# Altium schematic sheet console_schematic_switches.SchDoc
size A4
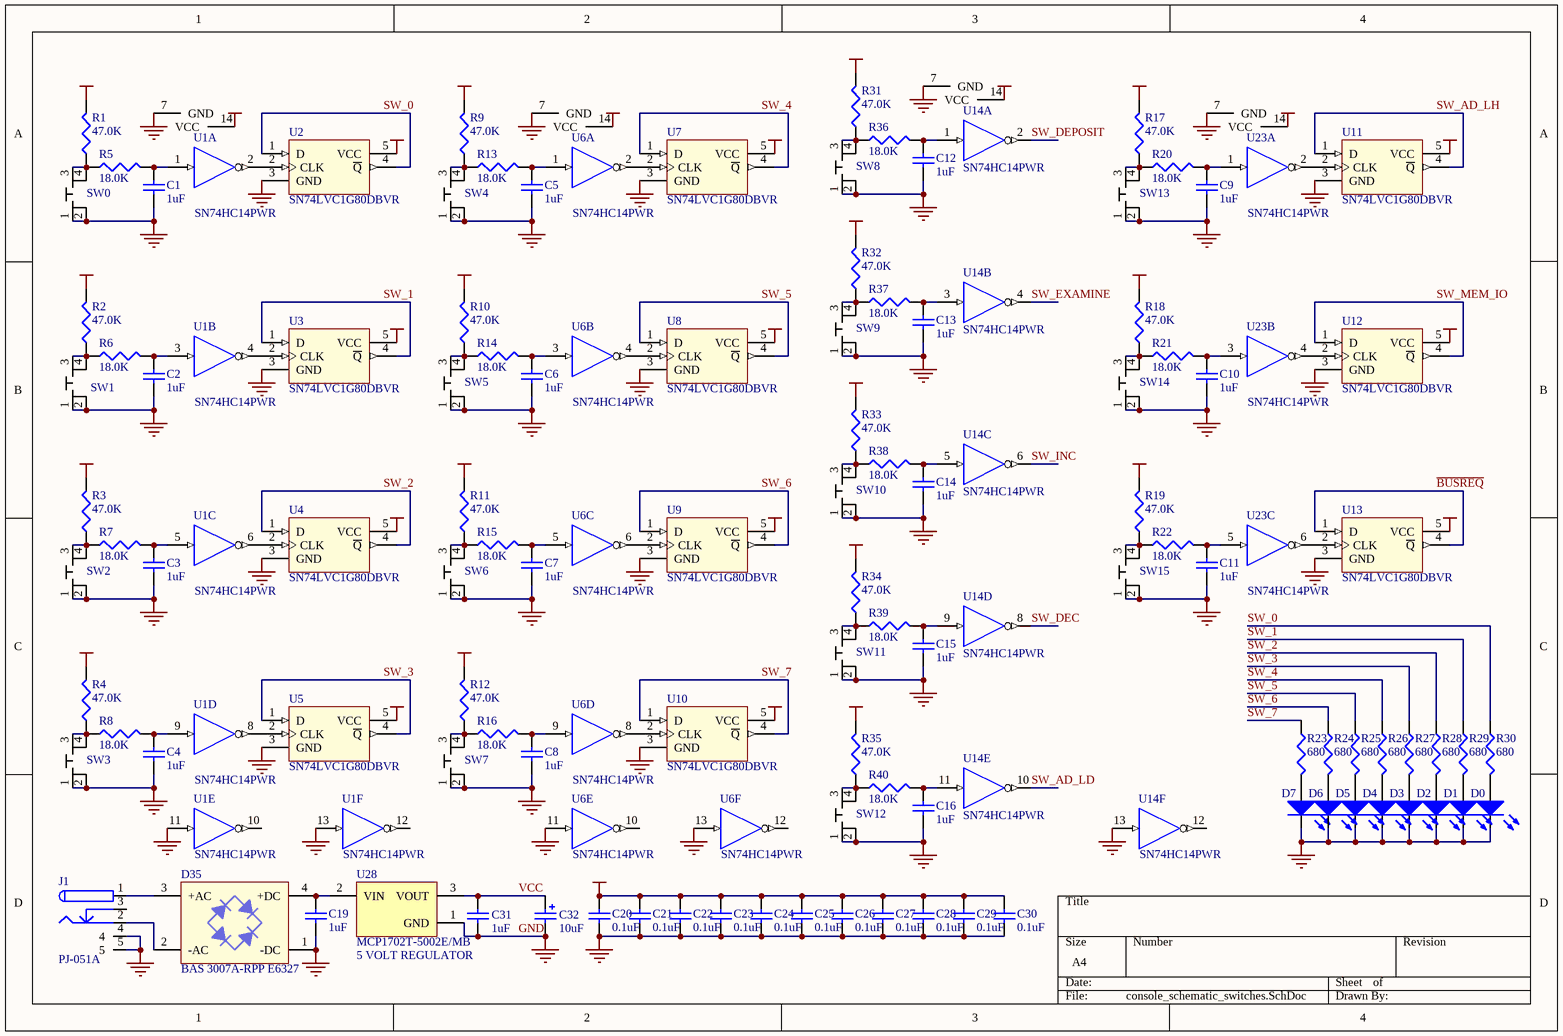
[diagram p0: console_schematic_switches.SchDoc]

## Parts
C1  1uF  [0805]
C2  1uF  [0805]
C3  1uF  [0805]
C4  1uF  [0805]
C5  1uF  [0805]
C6  1uF  [0805]
C7  1uF  [0805]
C8  1uF  [0805]
C9  1uF  [0805]
C10  1uF  [0805]
C11  1uF  [0805]
C12  1uF  [0805]
C13  1uF  [0805]
C14  1uF  [0805]
C15  1uF  [0805]
C16  1uF  [0805]
C19  1uF  [0805]
C20  0.1uF  [0603]
C21  0.1uF  [0603]
C22  0.1uF  [0603]
C23  0.1uF  [0603]
C24  0.1uF  [0603]
C25  0.1uF  [0603]
C26  0.1uF  [0603]
C27  0.1uF  [0603]
C28  0.1uF  [0603]
C29  0.1uF  [0603]
C30  0.1uF  [0603]
C31  1uF  [0805]
C32  10uF  [1206_A]
D0  LTST-C190KRKT  [APG1608]  (value not drawn)
D1  LTST-C190KRKT  [APG1608]  (value not drawn)
D2  LTST-C190KRKT  [APG1608]  (value not drawn)
D3  LTST-C190KRKT  [APG1608]  (value not drawn)
D4  LTST-C190KRKT  [APG1608]  (value not drawn)
D5  LTST-C190KRKT  [APG1608]  (value not drawn)
D6  LTST-C190KRKT  [APG1608]  (value not drawn)
D7  LTST-C190KRKT  [APG1608]  (value not drawn)
D35  BAS 3007A-RPP E6327  [SOT143]
J1  PJ-051A  [PJ-051A]
R1  47.0K  [0603]
R2  47.0K  [0603]
R3  47.0K  [0603]
R4  47.0K  [0603]
R5  18.0K  [0603]
R6  18.0K  [0603]
R7  18.0K  [0603]
R8  18.0K  [0603]
R9  47.0K  [0603]
R10  47.0K  [0603]
R11  47.0K  [0603]
R12  47.0K  [0603]
R13  18.0K  [0603]
R14  18.0K  [0603]
R15  18.0K  [0603]
R16  18.0K  [0603]
R17  47.0K  [0603]
R18  47.0K  [0603]
R19  47.0K  [0603]
R20  18.0K  [0603]
R21  18.0K  [0603]
R22  18.0K  [0603]
R23  680  [0603]
R24  680  [0603]
R25  680  [0603]
R26  680  [0603]
R27  680  [0603]
R28  680  [0603]
R29  680  [0603]
R30  680  [0603]
R31  47.0K  [0603]
R32  47.0K  [0603]
R33  47.0K  [0603]
R34  47.0K  [0603]
R35  47.0K  [0603]
R36  18.0K  [0603]
R37  18.0K  [0603]
R38  18.0K  [0603]
R39  18.0K  [0603]
R40  18.0K  [0603]
SW0  PTS645SM43SMTR LFS  [PTS645SM43SMTR LFS]  (value not drawn)
SW1  PTS645SM43SMTR LFS  [PTS645SM43SMTR LFS]  (value not drawn)
SW2  PTS645SM43SMTR LFS  [PTS645SM43SMTR LFS]  (value not drawn)
SW3  PTS645SM43SMTR LFS  [PTS645SM43SMTR LFS]  (value not drawn)
SW4  PTS645SM43SMTR LFS  [PTS645SM43SMTR LFS]  (value not drawn)
SW5  PTS645SM43SMTR LFS  [PTS645SM43SMTR LFS]  (value not drawn)
SW6  PTS645SM43SMTR LFS  [PTS645SM43SMTR LFS]  (value not drawn)
SW7  PTS645SM43SMTR LFS  [PTS645SM43SMTR LFS]  (value not drawn)
SW8  PTS645SM43SMTR LFS  [PTS645SM43SMTR LFS]  (value not drawn)
SW9  PTS645SM43SMTR LFS  [PTS645SM43SMTR LFS]  (value not drawn)
SW10  PTS645SM43SMTR LFS  [PTS645SM43SMTR LFS]  (value not drawn)
SW11  PTS645SM43SMTR LFS  [PTS645SM43SMTR LFS]  (value not drawn)
SW12  PTS645SM43SMTR LFS  [PTS645SM43SMTR LFS]  (value not drawn)
SW13  PTS645SM43SMTR LFS  [PTS645SM43SMTR LFS]  (value not drawn)
SW14  PTS645SM43SMTR LFS  [PTS645SM43SMTR LFS]  (value not drawn)
SW15  PTS645SM43SMTR LFS  [PTS645SM43SMTR LFS]  (value not drawn)
U1  SN74HC14PWR  [PW014]  (parts A,B,C,D,E,F of 6)
U2  SN74LVC1G80DBVR  [SOT-23-5 DBV R-PDSO-G5]
U3  SN74LVC1G80DBVR  [SOT-23-5 DBV R-PDSO-G5]
U4  SN74LVC1G80DBVR  [SOT-23-5 DBV R-PDSO-G5]
U5  SN74LVC1G80DBVR  [SOT-23-5 DBV R-PDSO-G5]
U6  SN74HC14PWR  [PW014]  (parts A,B,C,D,E,F of 6)
U7  SN74LVC1G80DBVR  [SOT-23-5 DBV R-PDSO-G5]
U8  SN74LVC1G80DBVR  [SOT-23-5 DBV R-PDSO-G5]
U9  SN74LVC1G80DBVR  [SOT-23-5 DBV R-PDSO-G5]
U10  SN74LVC1G80DBVR  [SOT-23-5 DBV R-PDSO-G5]
U11  SN74LVC1G80DBVR  [SOT-23-5 DBV R-PDSO-G5]
U12  SN74LVC1G80DBVR  [SOT-23-5 DBV R-PDSO-G5]
U13  SN74LVC1G80DBVR  [SOT-23-5 DBV R-PDSO-G5]
U14  SN74HC14PWR  [PW014]  (parts A,B,C,D,E,F of 6)
U23  SN74HC14PWR  [PW014]  (parts A,B,C of 6)
U28  MCP1702T-5002E/MB  Notes: 5 VOLT REGULATOR  [SOT-89]

## Nets
GND: C1.1 C2.1 C3.1 C4.1 C5.1 C6.1 C7.1 C8.1 C9.1 C10.1 C11.1 C12.1 C13.1 C14.1 C15.1 C16.1 C19.2 C20.1 C21.1 C22.1 C23.1 C24.1 C25.1 C26.1 C27.1 C28.1 C29.1 C30.1 C31.2 C32.2 D0.2(K) D1.2(K) D2.2(K) D3.2(K) D4.2(K) D5.2(K) D6.2(K) D7.2(K) D35.1(-DC) J1.4 J1.5 SW0.1 SW0.2 SW1.1 SW1.2 SW2.1 SW2.2 SW3.1 SW3.2 SW4.1 SW4.2 SW5.1 SW5.2 SW6.1 SW6.2 SW7.1 SW7.2 SW8.1 SW8.2 SW9.1 SW9.2 SW10.1 SW10.2 SW11.1 SW11.2 SW12.1 SW12.2 SW13.1 SW13.2 SW14.1 SW14.2 SW15.1 SW15.2 U1.7(GND) U1.11(A) U1.13(A) U2.3(GND) U3.3(GND) U4.3(GND) U5.3(GND) U6.7(GND) U6.11(A) U6.13(A) U7.3(GND) U8.3(GND) U9.3(GND) U10.3(GND) U11.3(GND) U12.3(GND) U13.3(GND) U14.7(GND) U14.13(A) U23.7(GND) U28.1(GND)
VCC: C20.2 C21.2 C22.2 C23.2 C24.2 C25.2 C26.2 C27.2 C28.2 C29.2 C30.2 C31.1 C32.1 R1.2 R2.2 R3.2 R4.2 R9.2 R10.2 R11.2 R12.2 R17.2 R18.2 R19.2 R31.2 R32.2 R33.2 R34.2 R35.2 U1.14(VCC) U2.5(VCC) U3.5(VCC) U4.5(VCC) U5.5(VCC) U6.14(VCC) U7.5(VCC) U8.5(VCC) U9.5(VCC) U10.5(VCC) U11.5(VCC) U12.5(VCC) U13.5(VCC) U14.14(VCC) U23.14(VCC) U28.3(VOUT)
~{BUSREQ}: U13.1(D) U13.4(~{Q})
SW_0: R30.1 U2.1(D) U2.4(~{Q})
SW_1: R29.1 U3.1(D) U3.4(~{Q})
SW_2: R28.1 U4.1(D) U4.4(~{Q})
SW_3: R27.1 U5.1(D) U5.4(~{Q})
SW_4: R26.1 U7.1(D) U7.4(~{Q})
SW_5: R25.1 U8.1(D) U8.4(~{Q})
SW_6: R24.1 U9.1(D) U9.4(~{Q})
SW_7: R23.1 U10.1(D) U10.4(~{Q})
SW_AD_LD: U14.10(~{Y})
SW_AD_LH: U11.1(D) U11.4(~{Q})
SW_DEC: U14.8(~{Y})
SW_DEPOSIT: U14.2(~{Y})
SW_EXAMINE: U14.4(~{Y})
SW_INC: U14.6(~{Y})
SW_MEM_IO: U12.1(D) U12.4(~{Q})
NetC1_2: C1.2 R5.2 U1.1(A)
NetC2_2: C2.2 R6.2 U1.3(A)
NetC3_2: C3.2 R7.2 U1.5(A)
NetC4_2: C4.2 R8.2 U1.9(A)
NetC5_2: C5.2 R13.2 U6.1(A)
NetC6_2: C6.2 R14.2 U6.3(A)
NetC7_2: C7.2 R15.2 U6.5(A)
NetC8_2: C8.2 R16.2 U6.9(A)
NetC9_2: C9.2 R20.2 U23.1(A)
NetC10_2: C10.2 R21.2 U23.3(A)
NetC11_2: C11.2 R22.2 U23.5(A)
NetC12_2: C12.2 R36.2 U14.1(A)
NetC13_2: C13.2 R37.2 U14.3(A)
NetC14_2: C14.2 R38.2 U14.5(A)
NetC15_2: C15.2 R39.2 U14.9(A)
NetC16_2: C16.2 R40.2 U14.11(A)
NetC19_1: C19.1 D35.4(+DC) U28.2(VIN)
NetD0_1: D0.1(A) R30.2
NetD1_1: D1.1(A) R29.2
NetD2_1: D2.1(A) R28.2
NetD3_1: D3.1(A) R27.2
NetD4_1: D4.1(A) R26.2
NetD5_1: D5.1(A) R25.2
NetD6_1: D6.1(A) R24.2
NetD7_1: D7.1(A) R23.2
NetD35_2: D35.2(-AC) J1.2
NetD35_3: D35.3(+AC) J1.1
NetR1_1: R1.1 R5.1 SW0.3 SW0.4
NetR2_1: R2.1 R6.1 SW1.3 SW1.4
NetR3_1: R3.1 R7.1 SW2.3 SW2.4
NetR4_1: R4.1 R8.1 SW3.3 SW3.4
NetR9_1: R9.1 R13.1 SW4.3 SW4.4
NetR10_1: R10.1 R14.1 SW5.3 SW5.4
NetR11_1: R11.1 R15.1 SW6.3 SW6.4
NetR12_1: R12.1 R16.1 SW7.3 SW7.4
NetR17_1: R17.1 R20.1 SW13.3 SW13.4
NetR18_1: R18.1 R21.1 SW14.3 SW14.4
NetR19_1: R19.1 R22.1 SW15.3 SW15.4
NetR31_1: R31.1 R36.1 SW8.3 SW8.4
NetR32_1: R32.1 R37.1 SW9.3 SW9.4
NetR33_1: R33.1 R38.1 SW10.3 SW10.4
NetR34_1: R34.1 R39.1 SW11.3 SW11.4
NetR35_1: R35.1 R40.1 SW12.3 SW12.4
NetU1_2: U1.2(~{Y}) U2.2(CLK)
NetU1_4: U1.4(~{Y}) U3.2(CLK)
NetU1_6: U1.6(~{Y}) U4.2(CLK)
NetU1_8: U1.8(~{Y}) U5.2(CLK)
NetU6_2: U6.2(~{Y}) U7.2(CLK)
NetU6_4: U6.4(~{Y}) U8.2(CLK)
NetU6_6: U6.6(~{Y}) U9.2(CLK)
NetU6_8: U6.8(~{Y}) U10.2(CLK)
NetU11_2: U11.2(CLK) U23.2(~{Y})
NetU12_2: U12.2(CLK) U23.4(~{Y})
NetU13_2: U13.2(CLK) U23.6(~{Y})

Not connected (* = marked no-connect by the designer): J1 3; U1 10(~{Y}) 12(~{Y}); U6 10(~{Y}) 12(~{Y}); U14 12(~{Y})

## Library data of the parts
C1-C16 C19 = C0805: CAP 1.0UF 16V CERAMIC X7R 0805; Dist: Digi-key; DistPN: 399-1284-1-ND; Load: yes; Mfgr: Kemet; MfgrPN: C0805C105K4RACTU; Polarized: no; Value: 1uF; Package: 0805
  C19: Notes: *
C20 = C0603: CAP .10UF 16V CERAMIC X7R 0603; Dist: Digi-Key; DistPN: 399-1096-1-ND; Load: yes; Mfgr: Kemet; MfgrPN: C0603C104K4RACTU; Polarized: no; Value: 0.1uF; Notes: *; Package: 0603
C21-C30 = C0603: CAP .10UF 16V CERAMIC X7R 0603; Dist: Digi-key; DistPN: 399-1096-1-ND; Load: yes; Mfgr: Kemet; MfgrPN: C0603C104K4RACTU; Polarized: no; Value: 0.1uF; Notes: *; Package: 0603
C31 = C0805: CAP 1.0UF 16V CERAMIC X7R 0805; Dist: Digi-Key; DistPN: 399-1284-1-ND; Load: yes; Mfgr: Kemet; MfgrPN: C0805C105K4RACTU; Polarized: no; Value: 1uF; Notes: *; Package: 0805
C32 = T491A: CAPACITOR TANT 10UF 10V 10% SMD; Dist: Avnet; DistPN: T491A106K010AT/BKN; Load: yes; Mfgr: Kemet; MfgrPN: T491A106K010AT; Value: 10uF; Notes: *; Package: 1206; Polarized: YES
D0-D7 = LTST-C190KRKT: LED SUPER RED CLEAR 0603 SMD; Dist: Digikey; DistPN: 160-1436-2-ND; Load: yes; Mfgr: Lite-On; MfgrPN: LTST-C190KRKT; Package: 0603; Polarized: yes; Value: LTST-C190KRKT
D35 = BAS 3007A-RPP E6327: DIODE SCHOTTKY 30V 900MA SOT143; Dist: Digi-Key; DistPN: BAS3007A-RPPE6327INCT-ND; Load: yes; Mfgr: Infineon Technologies; MfgrPN: BAS 3007A-RPP E6327; Notes: *; Package: SOT-143; Polarized: yes; Value: BAS 3007A-RPP E6327
J1 = PJ-051A: CON PWR JCK 2.0 X 6.0MM W/SHLD; Dist: Digi-Key; DistPN: CP-051A-ND; Load: yes; Mfgr: CUI Inc; MfgrPN: PJ-051A; Package: PTH; Polarized: yes; Value: PJ-051A
R1-R4 R9-R12 R17-R19 R31-R35 = MCR03EZPFX: RES 47.0K OHM 1/10W 1% 0603 SMD; Dist: Digi-Key; DistPN: P47.0KHCT-ND; Mfgr: Panasonic; MfgrPN: ERJ-3EKF4702V; Load: yes; Polarized: no; Value: 47.0K; Package: 0603
R5-R8 R13-R16 R20-R22 R36-R40 = MCR03EZPFX: RES 18.0K OHM 1/10W 1% 0603 SMD; Dist: Digi-Key; DistPN: P18.0KHCT-ND; Mfgr: Panasonic; MfgrPN: ERJ-3EKF1802V; Load: yes; Polarized: no; Value: 18.0K; Package: 0603
R23-R30 = MCR03EZPFX: RES 680 OHM 1/10W 1% 0603 SMD; Dist: Digi-Key; DistPN: P680HCT-ND; Mfgr: Panasonic; MfgrPN: ERJ-3EKF6800V; Load: yes; Polarized: no; Value: 680; Package: 0603
SW0-SW15 = PTS645SM43SMTR LFS: SWITCH TACT 6MM 160GF H=4.3MM; Dist: Mouser; DistPN: 611-PTS645SM43SMTRLF; Load: yes; Mfgr: C&K Components; Polarized: no; MfgrPN: PTS645SM43SMTR LFS; Package: SMD-6x6
U1 U6 U14 U23 = SN74HC14PWR: IC HEX SCHMITT-TRIG INV 14-TSSOP; Dist: Avnet; DistPN: SN74HC14PWR/BKN; Load: yes; Mfgr: Texas Instruments; MfgrPN: SN74HC14PWR; Package: TSSOP-14; Polarized: yes; Value: SN74HC14PWR
U2-U5 U7-U13 = SN74LVC1G80DBVR: IC POSITIVE D-TYPE F-F SOT-23-5; Dist: Digi-key; DistPN: 296-9851-1-ND; Load: yes; Mfgr: Texas Instruments; MfgrPN: SN74LVC1G80DBVR; Package: SOT-23-5; Polarized: yes; Value: SN74LVC1G80DBVR
U28 = MCP1702T-5002E/MB: IC REG LDO 5V 250MA SOT-89-3; Dist: Mouser; DistPN: 579-MCP1702T5002E/MB; Load: yes; Mfgr: Microchip; MfgrPN: MCP1702T-5002E/MB; Package: SOT-89; Polarized: YES; Value: MCP1702T-5002E/MB